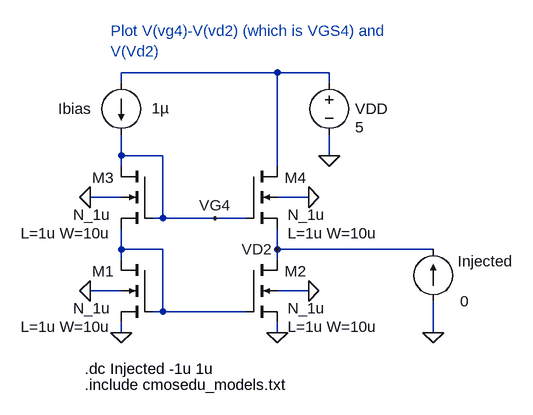
[diagram p0: schematic Fig9_8.asc]
Fig9_8.asc, the LTspice schematic file:
Version 4
SHEET 1 1136 680
WIRE 688 -176 448 -176
WIRE 768 -176 688 -176
WIRE 448 -160 448 -176
WIRE 768 -160 768 -176
WIRE 448 -48 448 -80
WIRE 512 -48 448 -48
WIRE 768 -48 768 -80
WIRE 448 -32 448 -48
WIRE 688 -32 688 -176
WIRE 448 16 400 16
WIRE 736 16 688 16
WIRE 512 48 512 -48
WIRE 512 48 496 48
WIRE 592 48 512 48
WIRE 640 48 592 48
WIRE 448 96 448 64
WIRE 512 96 448 96
WIRE 688 96 688 64
WIRE 928 96 688 96
WIRE 448 112 448 96
WIRE 688 112 688 96
WIRE 448 160 400 160
WIRE 736 160 688 160
WIRE 512 192 512 96
WIRE 512 192 496 192
WIRE 640 192 512 192
WIRE 448 224 448 208
WIRE 688 224 688 208
WIRE 928 224 928 176
FLAG 688 224 0
FLAG 768 -48 0
FLAG 736 160 0
FLAG 736 16 0
FLAG 448 224 0
FLAG 400 160 0
FLAG 400 16 0
FLAG 592 48 VG4
FLAG 688 96 VD2
FLAG 928 224 0
SYMBOL nmos4 640 112 R0
WINDOW 0 59 18 Left 0
WINDOW 3 64 75 Left 0
WINDOW 123 64 103 Left 0
SYMATTR InstName M2
SYMATTR Value N_1u
SYMATTR Value2 L=1u W=10u
SYMBOL voltage 768 -176 R0
WINDOW 0 40 56 Left 0
WINDOW 3 40 84 Left 0
WINDOW 123 0 0 Left 0
WINDOW 39 0 0 Left 0
SYMATTR InstName VDD
SYMATTR Value 5
SYMBOL current 448 -160 R0
WINDOW 0 -97 40 Left 0
WINDOW 3 47 39 Left 0
WINDOW 123 0 0 Left 0
WINDOW 39 0 0 Left 0
SYMATTR InstName Ibias
SYMATTR Value 1µ
SYMBOL nmos4 640 -32 R0
WINDOW 0 59 18 Left 0
WINDOW 3 64 75 Left 0
WINDOW 123 64 103 Left 0
SYMATTR InstName M4
SYMATTR Value N_1u
SYMATTR Value2 L=1u W=10u
SYMBOL nmos4 496 112 M0
WINDOW 0 59 18 Left 0
WINDOW 3 64 75 Left 0
WINDOW 123 64 103 Left 0
SYMATTR InstName M1
SYMATTR Value N_1u
SYMATTR Value2 L=1u W=10u
SYMBOL nmos4 496 -32 M0
WINDOW 0 59 18 Left 0
WINDOW 3 64 75 Left 0
WINDOW 123 64 103 Left 0
SYMATTR InstName M3
SYMATTR Value N_1u
SYMATTR Value2 L=1u W=10u
SYMBOL current 928 176 R180
WINDOW 0 -122 62 Left 0
WINDOW 3 -55 0 Left 0
SYMATTR InstName Injected
SYMATTR Value 0
TEXT 392 280 Left 0 !.dc Injected -1u 1u 
TEXT 392 304 Left 0 !.include cmosedu_models.txt
TEXT 432 -240 Left 0 ;Plot V(vg4)-V(vd2) (which is VGS4) and\nV(Vd2)

The netlist it stands for:
* Fig9_8.asc
M2 VD2 N002 0 0 N_1u L=1u W=10u
VDD N001 0 5
Ibias N001 VG4 1µ
M4 N001 VG4 VD2 0 N_1u L=1u W=10u
M1 N002 N002 0 0 N_1u L=1u W=10u
M3 VG4 VG4 N002 0 N_1u L=1u W=10u
Injected 0 VD2 0
.model NMOS NMOS
.model PMOS PMOS
.lib standard.mos
.dc Injected -1u 1u
.include cmosedu_models.txt
* Plot V(vg4)-V(vd2) (which is VGS4) and
* V(Vd2)
.backanno
.end